# Altium project alps_adapter.PrjPcb
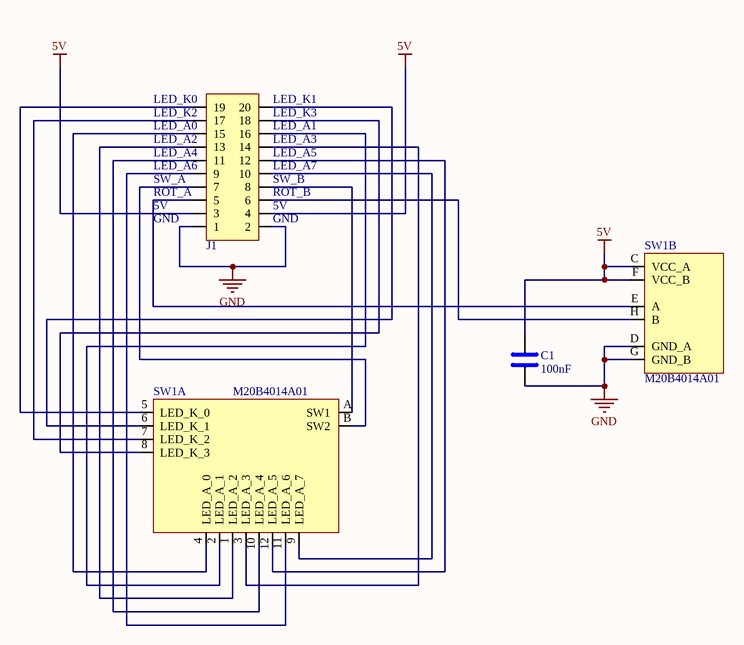
[diagram p0: alps_adapter.SchDoc]
1 sheet, 3 parts. Net scope: global (net labels, ports and power ports of the same name join across sheets).
Board file: alps_adapter.PcbDoc

## Sheet alps_adapter.SchDoc
size A4

### Parts
C1  value 100nF  [0805]  (hidden comment: 100nF 50V MLCC 0805)
J1  Wannenstecker 20pol 2,54mm  [WSL20G]  (value not drawn)
SW1  M20B4014A01  [ALPS_EM20B4014A01-LED]  (parts A,B of 2)

### Nets
5V: C1.1 J1.3 J1.4 SW1.C(VCC_A) SW1.F(VCC_B)
GND: C1.2 J1.1 J1.2 SW1.D(GND_A) SW1.G(GND_B)
NetJ1_5: J1.5 SW1.E(A)
NetJ1_6: J1.6 SW1.H(B)
NetJ1_7: J1.7 SW1.B(SW2)
NetJ1_8: J1.8 SW1.A(SW1)
NetJ1_9: J1.9 SW1.11(LED_A_6)
NetJ1_10: J1.10 SW1.9(LED_A_7)
NetJ1_11: J1.11 SW1.10(LED_A_4)
NetJ1_12: J1.12 SW1.12(LED_A_5)
NetJ1_13: J1.13 SW1.1(LED_A_2)
NetJ1_14: J1.14 SW1.3(LED_A_3)
NetJ1_15: J1.15 SW1.4(LED_A_0)
NetJ1_16: J1.16 SW1.2(LED_A_1)
NetJ1_17: J1.17 SW1.7(LED_K_2)
NetJ1_18: J1.18 SW1.8(LED_K_3)
NetJ1_19: J1.19 SW1.5(LED_K_0)
NetJ1_20: J1.20 SW1.6(LED_K_1)

### Notes on the sheet
- (near J1) LED_K0
- (near J1) LED_K2
- (near J1) LED_A0
- (near J1) LED_A2
- (near J1) LED_K1
- (near J1) LED_K3
- (near J1) LED_A1
- (near J1) LED_A3
- (near J1) LED_A4
- (near J1) LED_A6
- (near J1) ROT_A
- (near J1) SW_A
- (near J1) 5V
- (near J1) LED_A5
- (near J1) LED_A7
- (near J1) ROT_B
- (near J1) SW_B
- (near J1) GND

### Library data of the parts
C1 = 100nF 50V MLCC 0805: Reichelt code: X7R-G0805 100N; dielectricum: X7R; voltage: 50V
J1 = Wannenstecker 20pol 2,54mm: Reichelt code: WSL 20G
SW1 = ALPS_EM20B4014A01-LED: ALPS magnetic rotary encoder with leds